# EAGLE schematic calibration-rig (EAGLE 6.4)
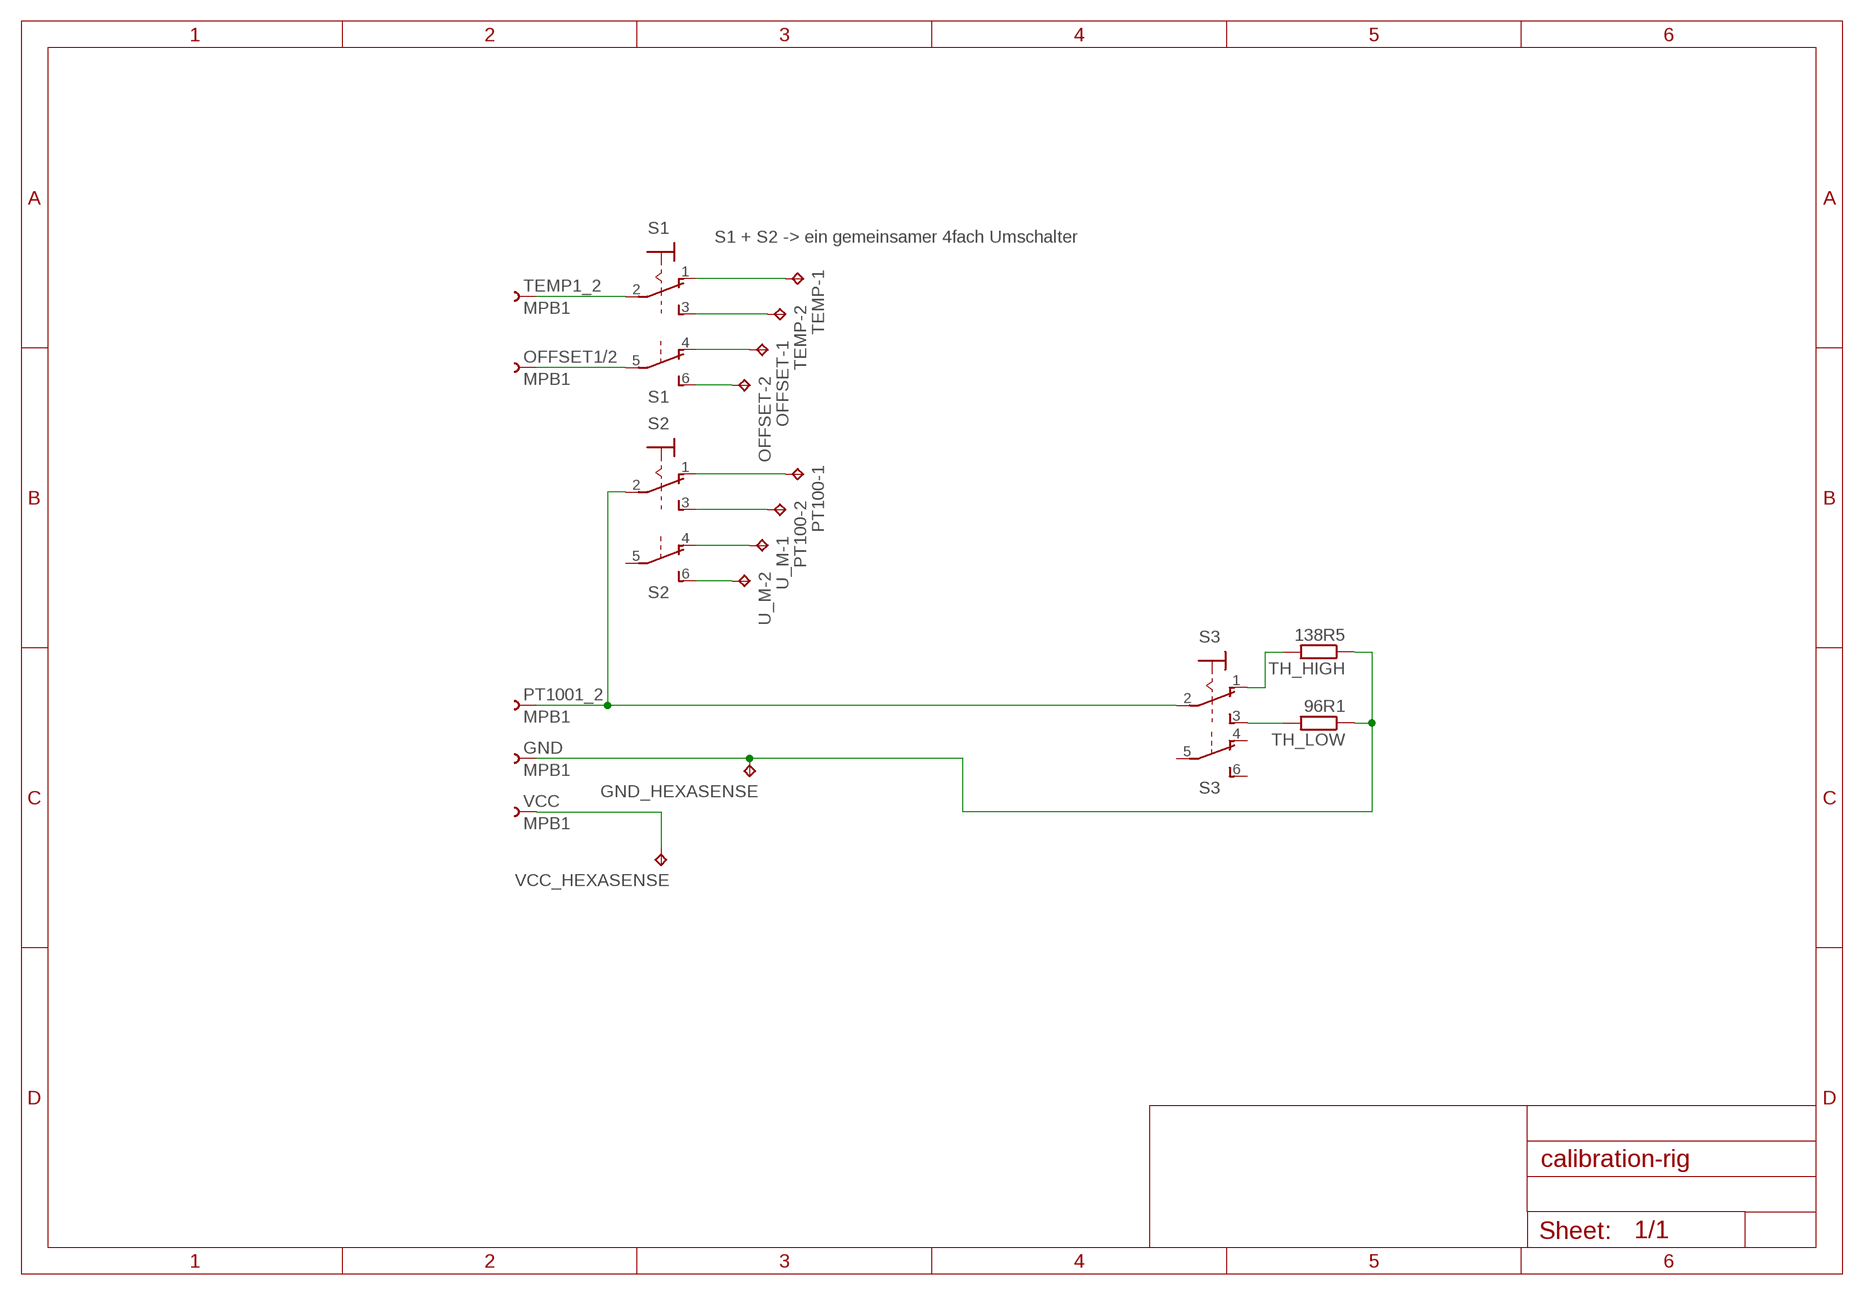
[diagram p0: schematic, sheet 1]

## Parts
GND  MPB1  [MPB1]
GND_HEXASENSE  TPB1,27  [B1,27]
OFFSET1/2  MPB1  [MPB1]
OFFSET-1  TPB1,27  [B1,27]
OFFSET-2  TPB1,27  [B1,27]
PT100-1  TPB1,27  [B1,27]
PT100-2  TPB1,27  [B1,27]
PT1001_2  MPB1  [MPB1]
S1  M9040P2  [M9040P2]
S2  M9040P2  [M9040P2]
S3  M9040P2  [M9040P2]
TEMP1_2  MPB1  [MPB1]
TEMP-1  TPB1,27  [B1,27]
TEMP-2  TPB1,27  [B1,27]
TH_HIGH  138R5  R-EU_0207/10  [0207/10]
TH_LOW  96R1  R-EU_0207/10  [0207/10]
U_M-1  TPB1,27  [B1,27]
U_M-2  TPB1,27  [B1,27]
VCC  MPB1  [MPB1]
VCC_HEXASENSE  TPB1,27  [B1,27]

## Nets
N$1: S3.1(1:O) TH_HIGH.2
N$2: S3.3(1:S) TH_LOW.2
N$3: GND.1 GND.1@1 GND_HEXASENSE.TP TH_HIGH.1 TH_LOW.1
N$4: PT100-1.TP S2.1(1:O)
N$5: PT1001_2.1 PT1001_2.1@1 S2.2(1:P) S3.2(1:P)
N$6: PT100-2.TP S2.3(1:S)
N$7: S1.3(1:S) TEMP-2.TP
N$8: S1.1(1:O) TEMP-1.TP
N$9: OFFSET-1.TP S1.4(2:O)
N$10: OFFSET-2.TP S1.6(2:S)
N$11: S1.2(1:P) TEMP1_2.1 TEMP1_2.1@1
N$12: OFFSET1/2.1 OFFSET1/2.1@1 S1.5(2:P)
N$13: VCC.1 VCC.1@1 VCC_HEXASENSE.TP
N$14: S2.4(2:O) U_M-1.TP
N$15: S2.6(2:S) U_M-2.TP
Unconnected: S2.5(2:P) S3.4(2:O) S3.5(2:P) S3.6(2:S)

## Notes on the sheet
- S1 + S2 -> ein gemeinsamer 4fach Umschalter

## Library data of the parts
GND OFFSET1/2 PT1001_2 TEMP1_2 VCC = con-hirschmann:MPB1: LAB CONNECTOR testpoint; MF: FARNELL; MPN: MPB1 BLACK; OC_FARNELL: unknown; OC_NEWARK: 06WX5859
GND_HEXASENSE OFFSET-1 OFFSET-2 PT100-1 PT100-2 TEMP-1 TEMP-2 U_M-1 U_M-2 VCC_HEXASENSE = testpad:TP: Test pad
S1-S3 = switch:M9040P2: TOGGLE SWITCH Marquardt
TH_HIGH TH_LOW = rcl:R-EU_: RESISTOR, European symbol